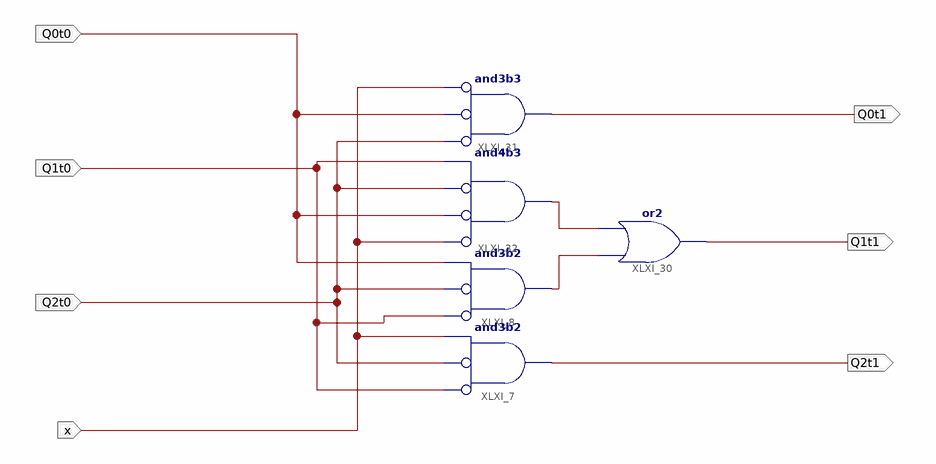
[diagram p0: schematic sheet 1]
// Xilinx ISE schematic logika.sch (spartan3e) as structural Verilog: 5 symbols, 7 ports
module logika (
  input  Q0t0,
  input  Q1t0,
  input  Q2t0,
  input  x,
  output Q0t1,
  output Q1t1,
  output Q2t1
);

  wire XLXN_80, XLXN_81;

  or XLXI_30 (Q1t1, XLXN_81, XLXN_80);
  and XLXI_8 (XLXN_81, ~Q1t0, ~Q2t0, Q0t0);  // and3b2
  and XLXI_7 (Q2t1, ~Q1t0, ~Q2t0, x);  // and3b2
  and XLXI_31 (Q0t1, ~Q2t0, ~Q0t0, ~x);  // and3b3
  and XLXI_32 (XLXN_80, ~x, ~Q0t0, ~Q2t0, Q1t0);  // and4b3
endmodule
